# Altium project soldering_station_controls.PrjPCB
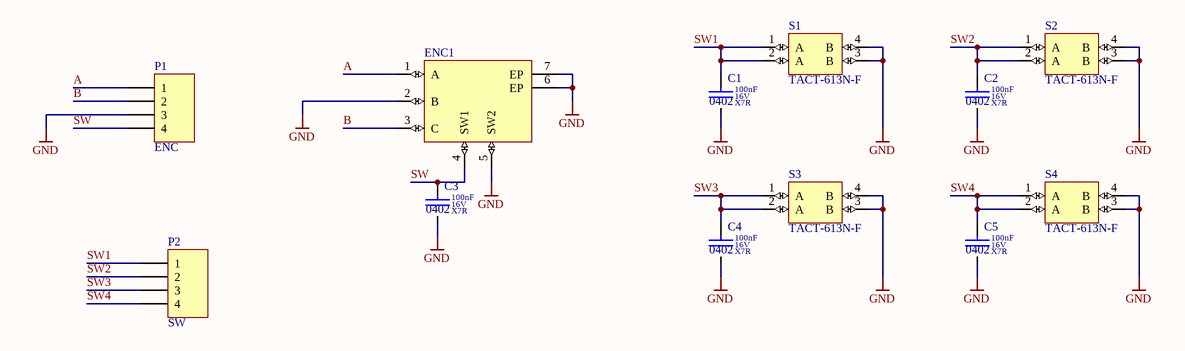
[diagram p0: soldering_station_controls.SchDoc]
1 sheet, 12 parts. Net scope: global (net labels, ports and power ports of the same name join across sheets).
Board file: soldering_station_controls.PcbDoc

## Sheet soldering_station_controls.SchDoc
size A4

### Parts
C1  value 100nF  Dielectric: X7R  Voltage: 16V  SCH_Footprint: 0402  [C_0402_1005]  (hidden comment: Ceramic X7R)
C2  value 100nF  Dielectric: X7R  Voltage: 16V  SCH_Footprint: 0402  [C_0402_1005]  (hidden comment: Ceramic X7R)
C3  value 100nF  Dielectric: X7R  Voltage: 16V  SCH_Footprint: 0402  [C_0402_1005]  (hidden comment: Ceramic X7R)
C4  value 100nF  Dielectric: X7R  Voltage: 16V  SCH_Footprint: 0402  [C_0402_1005]  (hidden comment: Ceramic X7R)
C5  value 100nF  Dielectric: X7R  Voltage: 16V  SCH_Footprint: 0402  [C_0402_1005]  (hidden comment: Ceramic X7R)
ENC1  Wurth Elektronik 482016514001  [ENCODER]  (value not drawn)
P1  ENC  [P_HEADER_1x4_2.54]
P2  SW  [P_HEADER_1x4_2.54]
S1  TACT-613N-F  [TACT-613N-F]
S2  TACT-613N-F  [TACT-613N-F]
S3  TACT-613N-F  [TACT-613N-F]
S4  TACT-613N-F  [TACT-613N-F]

### Nets
GND: C1.2 C2.2 C3.2 C4.2 C5.2 ENC1.2(B) ENC1.5(SW2) ENC1.6(EP) ENC1.7(EP) P1.3 S1.3(B) S1.4(B) S2.3(B) S2.4(B) S3.3(B) S3.4(B) S4.3(B) S4.4(B)
A: ENC1.1(A) P1.1
B: ENC1.3(C) P1.2
SW: C3.1 ENC1.4(SW1) P1.4
SW1: C1.1 P2.1 S1.1(A) S1.2(A)
SW2: C2.1 P2.2 S2.1(A) S2.2(A)
SW3: C4.1 P2.3 S3.1(A) S3.2(A)
SW4: C5.1 P2.4 S4.1(A) S4.2(A)

### Library data of the parts
C1-C5 = C_100nF_16V_X7R_0402_10: Capacitor; Manufacturer: Murata; Manufacturer Part Number: GRM155R71C104KA88D; Tolerance (%): 10; Part Number: C_100nF_16V_X7R_0402_10; HelpURL: https://www.mouser.com/ds/2/281/c02e-2905.pdf; Supplier 1: TME; Supplier 2: RS Components; Supplier 3: Farnell; Supplier 4: Mouser; Supplier Part Number 4: 81-GRM155R71C104KA88; Supplier 5: Digi-Key
ENC1 = ENCODER
P1 P2 = P_HEADER_1x4_2.54: Header, 4-Pin; Manufacturer: Connfly; Value: DS1021-1*4SF1-1; SCH_Footprint: 1x4 2.54mm; Part Number: P_HEADER_1x4_2.54; Component Type: Standard; HelpURL: http://datasheet.octopart.com/DS1021-1%2A4SF1-1-Connfly-datasheet-65537859.pdf; Manufacturer Part Number: DS1021-1*4SF1-1; Supplier 1: TME; Supplier Part Number 1: ZL201-04G; Supplier 2: RS Components; Supplier 3: Farnell; Supplier 4: Mouser; Supplier 5: Digi-Key